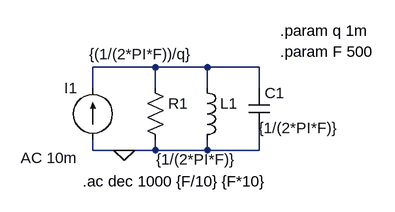
[diagram p0: schematic RLC - paralelo.asc]
RLC - paralelo.asc, the LTspice schematic file:
Version 4
SHEET 1 880 680
WIRE 112 64 16 64
WIRE 192 64 112 64
WIRE 272 64 192 64
WIRE 16 96 16 64
WIRE 112 96 112 64
WIRE 192 96 192 64
WIRE 272 96 272 64
WIRE 16 192 16 176
WIRE 64 192 16 192
WIRE 112 192 112 176
WIRE 112 192 64 192
WIRE 192 192 192 176
WIRE 192 192 112 192
WIRE 272 192 272 160
WIRE 272 192 192 192
FLAG 64 192 0
SYMBOL res 96 80 R0
WINDOW 3 -86 -36 Left 2
SYMATTR InstName R1
SYMATTR Value {(1/(2*PI*F))/q}
SYMBOL ind 176 80 R0
WINDOW 3 -63 126 Left 2
SYMATTR InstName L1
SYMATTR Value {1/(2*PI*F)}
SYMBOL cap 256 96 R0
WINDOW 3 15 62 Left 2
SYMATTR InstName C1
SYMATTR Value {1/(2*PI*F)}
SYMBOL current 16 176 R180
WINDOW 0 24 80 Left 2
WINDOW 3 24 0 Left 2
WINDOW 123 24 -28 Left 2
WINDOW 39 0 0 Left 0
SYMATTR InstName I1
SYMATTR Value ""
SYMATTR Value2 AC 10m
TEXT 0 240 Left 2 !.ac dec 1000 {F/10} {F*10}
TEXT 304 8 Left 2 !.param q 1m
TEXT 304 40 Left 2 !.param F 500

The netlist it stands for:
* RLC - paralelo.asc
R1 N001 0 {(1/(2*PI*F))/q}
L1 N001 0 {1/(2*PI*F)}
C1 N001 0 {1/(2*PI*F)}
I1 0 N001 AC 10m
.ac dec 1000 {F/10} {F*10}
.param q 1m
.param F 500
.backanno
.end